# Altium schematic sheet Quad FC power V10.1.SchDoc
size A4; SheetNumber: 2; SheetTotal: 2
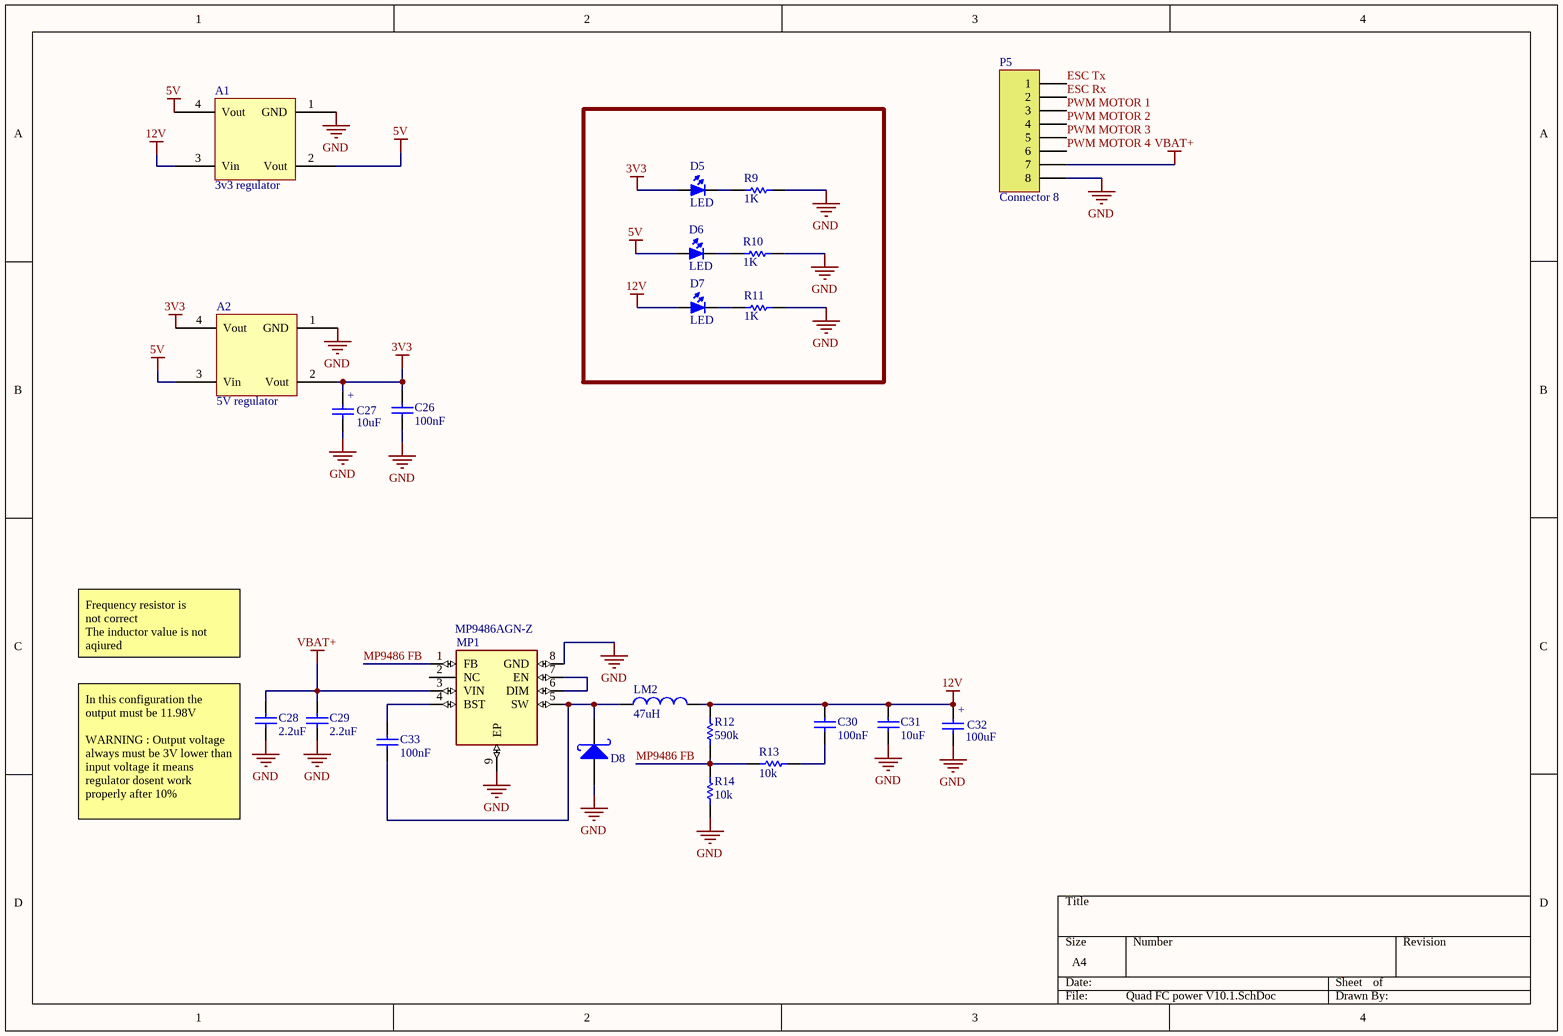
[diagram p0: Quad FC power V10.1.SchDoc]

## Parts
A1  3v3 regulator  [SOT230P700X180-4N]
A2  5V regulator  [SOT230P700X180-4N]
C26  100nF  [CAP0603]
C27  10uF  [MY_CAP_SMD-B]
C28  2.2uF  [CAPC3413X12N]
C29  2.2uF  [CAPC3413X12N]
C30  100nF  [CAP0603]
C31  10uF  [CAPC3413X12N]
C32  100uF  [MY_CAP_SMD-B]
C33  100nF  [CAP0603]
D5  LED  [0603 - LED]
D6  LED  [0603 - LED]
D7  LED  [0603 - LED]
D8  SS34  [DIOM4226X244N]  (value not drawn)
LM2  47uH  [IND_RLS-105]
MP1  MP9486AGN-Z  [SOIC127P600X170-9N]
P5  Connector 8  [JST B8B-PH-K]
R9  1K  [RES0603]
R10  1K  [RES0603]
R11  1K  [RES0603]
R12  590k  [RES0603]
R13  10k  [RES0603]
R14  10k  [RES0603]

## Nets
3V3: A2.2(Vout) A2.4(Vout) C26.2 C27.+ D5.1(A)
5V: A1.2(Vout) A1.4(Vout) A2.3(Vin) D6.1(A)
12V: A1.3(Vin) C30.2 C31.2 C32.+ D7.1(A) LM2.2 R12.2
GND: A1.1(GND) A2.1(GND) C26.1 C27.- C28.2 C29.2 C31.1 C32.- D8.1(A) MP1.8(GND) MP1.9(EP) P5.8 R9.2 R10.2 R11.2 R14.1
VBAT+: C28.1 C29.1 MP1.3(VIN) P5.7
ESC Rx: P5.2
ESC Tx: P5.1
MP9486 FB: MP1.1(FB) R12.1 R13.2 R14.2
PWM MOTOR 1: P5.3
PWM MOTOR 2: P5.4
PWM MOTOR 3: P5.5
PWM MOTOR 4: P5.6
NetC30_1: C30.1 R13.1
NetC33_1: C33.1 D8.2(K) LM2.1 MP1.5(SW)
NetC33_2: C33.2 MP1.4(BST)
NetD5_2: D5.2(K) R9.1
NetD6_2: D6.2(K) R10.1
NetD7_2: D7.2(K) R11.1
NetMP1_6: MP1.6(DIM) MP1.7(EN)

Not connected (* = marked no-connect by the designer): MP1 2(NC)

## Notes on the sheet
- Frequency resistor is
  not correct
  The inductor value is not aqiured
- (near C28) In this configuration the output must be 11.98V
  WARNING : Output voltage always must be 3V lower than input voltage it means regulator dosent work properly after 10%

## Library data of the parts
A1 A2 = ams1117
C26 C30 C33 = CAP SMD PACKAGE: F407VET6 Power CAP; Designer: Abbas Basereh; Desc.: CAP SMD TOTAL PACKAGES; Data: 2017-3-10
C27 C32 = CAP_TANTAL_B: 3.5X2.8MM; Value: 3300u
C28 C29 C31 = CAP SMD 0805: CAP 0805; Designer: Abbas Basereh; Desc.: CAP SMD 0805; Data: 16-12-2016
D8 = 1n5822 SMD: Manufacturer: ON Semiconductor/Fairchild; Designer: Abbas Basereh; Link: https://www.aliexpress.com/item/Free-shipping-100pcs-1n5822-sma-smd-do-214ac-Schottky-diode-ss34/32337482329.html?spm=2114.01010208.3.1.zLZDsP&ws_ab_test=searchweb0_0,searchweb201602_4_10065_10068_10084_10083_10080_10082_10081_10060_10061_10062_10056_10055_10054_10059_10099_10078_10079_427_10073_10103_10102_10096_10052_10050_10051,searchweb201603_4&btsid=6e50dc92-ac69-45bc-a19e-209af19ce602; Link: http://www.tme.eu/en/details/ss34/smd-schottky-diodes/vishay/ss34-e357t/; Link: http://www.digikey.com/product-detail/en/on-semiconductor-fairchild/SS34/SS34FSCT-ND/2094459; Part. No: SS34; Data: 16-12-2016
LM2 = L SMA 0.25W: Inductor; Code_IEC: 1005; Published: 8-Jun-2000; LatestRevisionDate: 29-May-2009; LatestRevisionNote: IPC-7351 Footprint Added.; PackageReference: 0402-A; Publisher: Altium Limited; PackageDescription: Chip Inductor; Code_JEITA: 0402
MP1 = MP9486AGN-Z: Buck Switching Regulator IC Positive Fixed 5V 1 Output 1A 8-SOIC (0.154, 3.90mm Width) Exposed Pad; MF: Monolithic Power; SnapEDA_Link: https://www.snapeda.com/parts/MP9486AGN-Z/Monolithic+Power+Systems+Inc./view-part/?ref=snap; Package: SOIC-8 Monolithic Power; Value: *; MP: MP9486AGN-Z; Check_prices: https://www.snapeda.com/parts/MP9486AGN-Z/Monolithic+Power+Systems+Inc./view-part/?ref=eda
P5 = Connector1x8: Connector, 8-Pin2.5mm; LatestRevisionDate: 17-Jul-2002; LatestRevisionNote: Re-released for DXP Platform.; Publisher: Altium Limited
R9-R11 = RES SMD PACKAGE: TOTAL SMD RESISTOR PACK; Designer: Abbas Basereh; Desc.: RES SMD PAKAGES; Data: 2017-3-10; VALUE: 1K
R12-R14 = RES SMD PACKAGE: To Limit current; Designer: Abbas Basereh; Desc.: RES SMD PAKAGES; VALUE: 1K; Data: 2017-3-10
D5-D7 = LED: Published: 8-Jun-2000; LatestRevisionDate: 08-Jul-2005; LatestRevisionNote: Mech Layer 1 removed.; PackageReference: LED-0; Publisher: Altium Limited